# Altium schematic sheet Microcontroller_sch_v22_2.SchDoc
size 104 x 111 mm; Origin: Eagle
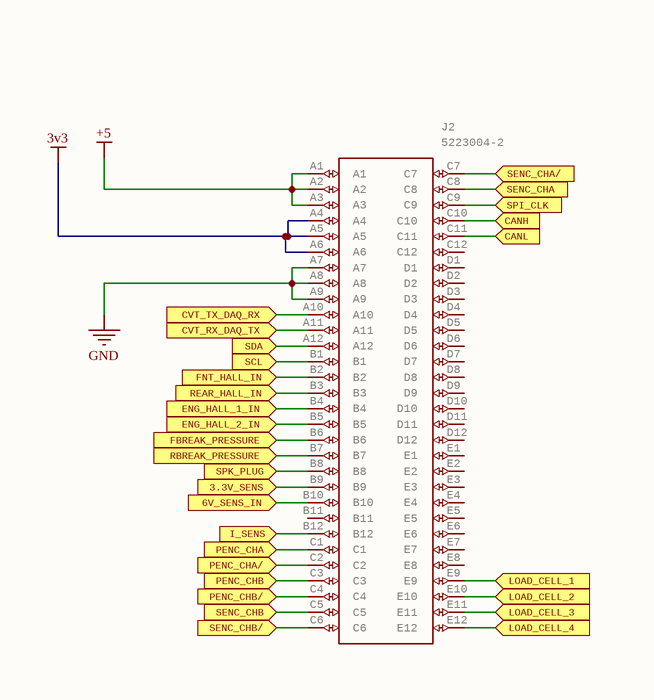
[diagram p0: Microcontroller_sch_v22_2.SchDoc]

## Parts
J2  5223004-2  [52230042]

## Ports
3.3V_SENS (in, see Microcontroller_sch_v22_1[2B]), 6V_SENS_IN (in, see Microcontroller_sch_v22_3[1A]), CANH (in, see Microcontroller_sch_v22_4[1B]), CANL (in, see Microcontroller_sch_v22_4[1B]), CVT_RX_DAQ_TX (in, see Microcontroller_sch_v22_0[3C], Microcontroller_sch_v22_1[0A]), CVT_TX_DAQ_RX (in, see Microcontroller_sch_v22_0[1B], Microcontroller_sch_v22_1[2C]), ENG_HALL_1_IN (in, see Microcontroller_sch_v22_3[4A]), ENG_HALL_2_IN (in, see Microcontroller_sch_v22_3[5A]), FBREAK_PRESSURE (in, see Microcontroller_sch_v22_0[1C], Microcontroller_sch_v22_1[0C]), FNT_HALL_IN (in, see Microcontroller_sch_v22_3[2A]), I_SENS (in, see Microcontroller_sch_v22_1[2B]), LOAD_CELL_1 (in, see Microcontroller_sch_v22_0[3B]), LOAD_CELL_2 (in, see Microcontroller_sch_v22_0[3B]), LOAD_CELL_3 (in, see Microcontroller_sch_v22_0[3B]), LOAD_CELL_4 (in, see Microcontroller_sch_v22_0[3B]), PENC_CHA (in, see Microcontroller_sch_v22_0[4A]), PENC_CHA/ (in, see Microcontroller_sch_v22_0[4A]), PENC_CHB (in, see Microcontroller_sch_v22_0[4B]), PENC_CHB/ (in, see Microcontroller_sch_v22_0[4B]), RBREAK_PRESSURE (in, see Microcontroller_sch_v22_0[1C], Microcontroller_sch_v22_1[0C]), REAR_HALL_IN (in, see Microcontroller_sch_v22_3[3A]), SCL (in, see Microcontroller_sch_v22_0[1C], Microcontroller_sch_v22_0[4C], Microcontroller_sch_v22_1[1C]), SDA (in, see Microcontroller_sch_v22_0[1C], Microcontroller_sch_v22_0[4C], Microcontroller_sch_v22_1[1C]), SENC_CHA (in, see Microcontroller_sch_v22_0[4B]), SENC_CHA/ (in, see Microcontroller_sch_v22_0[4B]), SENC_CHB (in, see Microcontroller_sch_v22_0[4B]), SENC_CHB/ (in, see Microcontroller_sch_v22_0[4B]), SPI_CLK (in, see Microcontroller_sch_v22_0[1B], Microcontroller_sch_v22_1[0B], Microcontroller_sch_v22_1[4C], Microcontroller_sch_v22_4[2C], Microcontroller_sch_v22_4[4C]), SPK_PLUG (in, see Microcontroller_sch_v22_0[1C], Microcontroller_sch_v22_1[0C])

## Nets
3v3: J2.A4 J2.A5 J2.A6
+5: J2.A1 J2.A2 J2.A3
GND: J2.A7 J2.A8 J2.A9
3.3V_SENS: J2.B9 ; port 3.3V_SENS
6V_SENS_IN: J2.B10 ; port 6V_SENS_IN
CANH: J2.C10 ; port CANH
CANL: J2.C11 ; port CANL
CVT_RX_DAQ_TX: J2.A11 ; port CVT_RX_DAQ_TX
CVT_TX_DAQ_RX: J2.A10 ; port CVT_TX_DAQ_RX
ENG_HALL_1_IN: J2.B4 ; port ENG_HALL_1_IN
ENG_HALL_2_IN: J2.B5 ; port ENG_HALL_2_IN
FBREAK_PRESSURE: J2.B6 ; port FBREAK_PRESSURE
FNT_HALL_IN: J2.B2 ; port FNT_HALL_IN
I_SENS: J2.B12 ; port I_SENS
LOAD_CELL_1: J2.E9 ; port LOAD_CELL_1
LOAD_CELL_2: J2.E10 ; port LOAD_CELL_2
LOAD_CELL_3: J2.E11 ; port LOAD_CELL_3
LOAD_CELL_4: J2.E12 ; port LOAD_CELL_4
PENC_CHA: J2.C1 ; port PENC_CHA
PENC_CHA/: J2.C2 ; port PENC_CHA/
PENC_CHB: J2.C3 ; port PENC_CHB
PENC_CHB/: J2.C4 ; port PENC_CHB/
RBREAK_PRESSURE: J2.B7 ; port RBREAK_PRESSURE
REAR_HALL_IN: J2.B3 ; port REAR_HALL_IN
SCL: J2.B1 ; port SCL
SDA: J2.A12 ; port SDA
SENC_CHA: J2.C8 ; port SENC_CHA
SENC_CHA/: J2.C7 ; port SENC_CHA/
SENC_CHB: J2.C5 ; port SENC_CHB
SENC_CHB/: J2.C6 ; port SENC_CHB/
SPI_CLK: J2.C9 ; port SPI_CLK
SPK_PLUG: J2.B8 ; port SPK_PLUG

Not connected (* = marked no-connect by the designer): J2 B11 C12 D1 D2 D3 D4 D5 D6 D7 D8 D9 D10 D11 D12 E1 E2 E3 E4 E5 E6 E7 E8

## Library data of the parts
J2 = 5223004-2: Conn Backplane RCP 60 POS 2mm Solder RA Thru-Hole Tube   Source:  Datasheet; MANUFACTURER_NAME: TE Connectivity; GateName_1: G$1; SymbolName_1: 5223004-2; LibraryName: SamacSys_Parts; DeviceSetName: 5223004-2; HEIGHT: 14mm; MANUFACTURER_PART_NUMBER: 5223004-2; MOUSER_PART_NUMBER: 571-5223004-2; MOUSER_PRICE-STOCK: https://www.mouser.co.uk/ProductDetail/TE-Connectivity/5223004-2?qs=oNRo%252BTjlpTO6tP0xSX%252BI3w%3D%3D